# Altium schematic sheet BoardB-FPGA2.SchDoc
size A; SheetNumber: 3; SheetTotal: 7
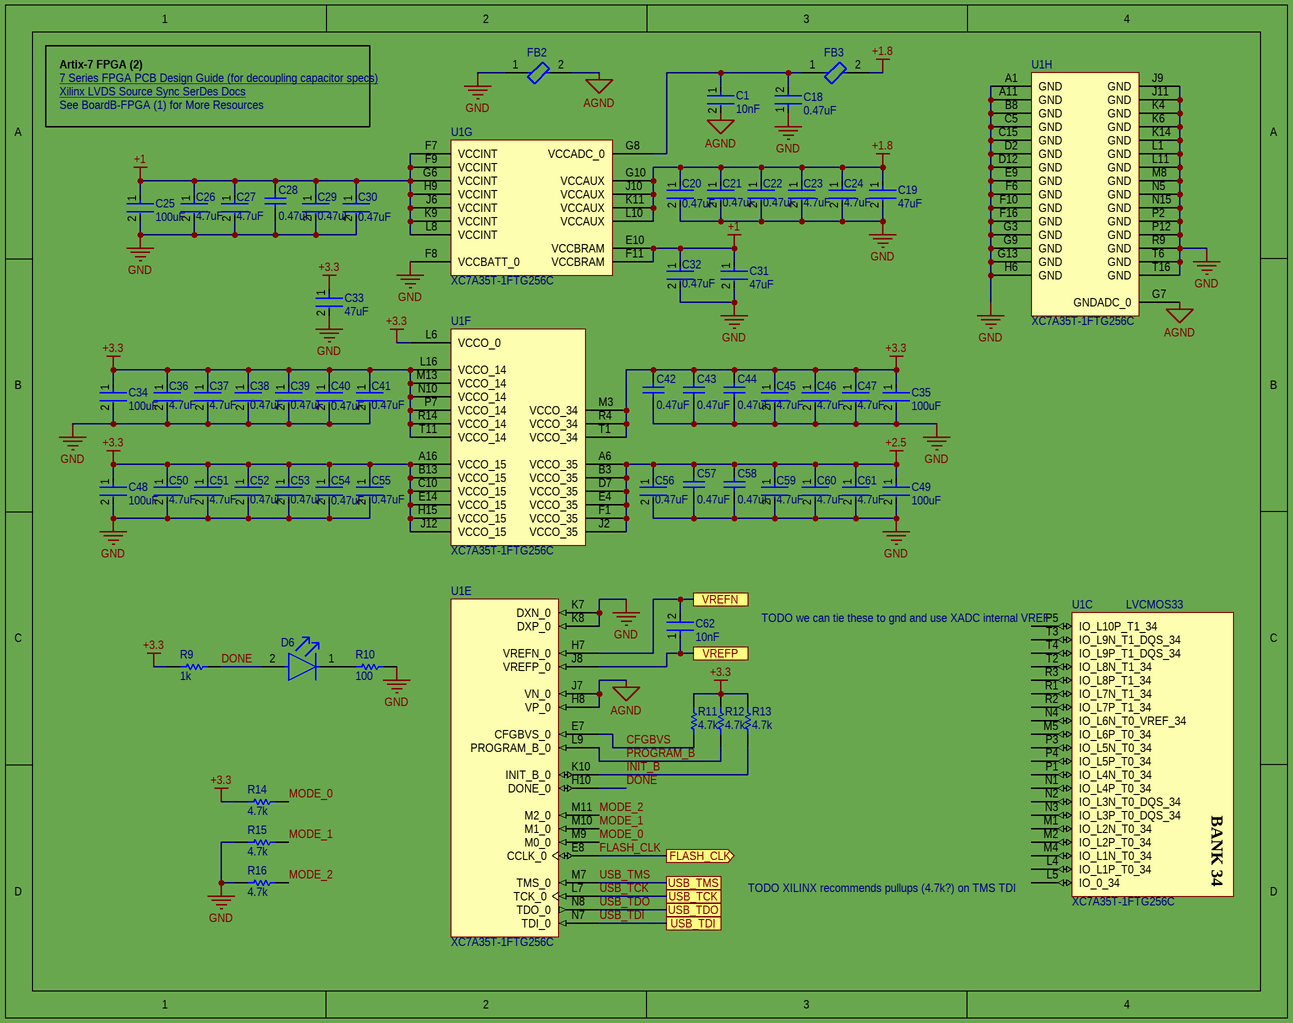
[diagram p0: BoardB-FPGA2.SchDoc]

## Parts
C1  10nF  [FP-GRM033-0_03-IPC_C]
C18  0.47uF  [FP-GRM033-0_03-IPC_C]
C19  47uF  [FP-GRM188-0_2-MFG]
C20  0.47uF  [FP-GRM033-0_03-IPC_C]
C21  0.47uF  [FP-GRM033-0_03-IPC_C]
C22  0.47uF  [FP-GRM033-0_03-IPC_C]
C23  4.7uF  [FP-GRM155-0_1-IPC_B]
C24  4.7uF  [FP-GRM155-0_1-IPC_B]
C25  100uF  [FP-GRM21B-0_2-e0_2_0_7-MFG]
C26  4.7uF  [FP-GRM155-0_1-IPC_B]
C27  4.7uF  [FP-GRM155-0_1-IPC_B]
C28  0.47uF  [CAPC1005X55X25LL05T10]
C29  0.47uF  [FP-GRM033-0_03-IPC_C]
C30  0.47uF  [FP-GRM033-0_03-IPC_C]
C31  47uF  [FP-GRM188-0_2-MFG]
C32  0.47uF  [FP-GRM033-0_03-IPC_C]
C33  47uF  [FP-GRM188-0_2-MFG]
C34  100uF  [FP-GRM21B-0_2-e0_2_0_7-MFG]
C35  100uF  [FP-GRM21B-0_2-e0_2_0_7-MFG]
C36  4.7uF  [FP-GRM155-0_1-IPC_B]
C37  4.7uF  [FP-GRM155-0_1-IPC_B]
C38  0.47uF  [FP-GRM033-0_03-IPC_C]
C39  0.47uF  [FP-GRM033-0_03-IPC_C]
C40  0.47uF  [FP-GRM033-0_03-IPC_C]
C41  0.47uF  [FP-GRM033-0_03-IPC_C]
C42  0.47uF  [CAPC1005X55X25LL05T10]
C43  0.47uF  [CAPC1005X55X25LL05T10]
C44  0.47uF  [CAPC1005X55X25LL05T10]
C45  4.7uF  [FP-GRM155-0_1-IPC_B]
C46  4.7uF  [FP-GRM155-0_1-IPC_B]
C47  4.7uF  [FP-GRM155-0_1-IPC_B]
C48  100uF  [FP-GRM21B-0_2-e0_2_0_7-MFG]
C49  100uF  [FP-GRM21B-0_2-e0_2_0_7-MFG]
C50  4.7uF  [FP-GRM155-0_1-IPC_B]
C51  4.7uF  [FP-GRM155-0_1-IPC_B]
C52  0.47uF  [FP-GRM033-0_03-IPC_C]
C53  0.47uF  [FP-GRM033-0_03-IPC_C]
C54  0.47uF  [FP-GRM033-0_03-IPC_C]
C55  0.47uF  [FP-GRM033-0_03-IPC_C]
C56  0.47uF  [FP-GRM033-0_03-IPC_C]
C57  0.47uF  [CAPC1005X55X25LL05T10]
C58  0.47uF  [CAPC1005X55X25LL05T10]
C59  4.7uF  [FP-GRM155-0_1-IPC_B]
C60  4.7uF  [FP-GRM155-0_1-IPC_B]
C61  4.7uF  [FP-GRM155-0_1-IPC_B]
C62  10nF  [FP-CC0201-BA-MFG]
D6  SML-D12U1WT86  [FP-SML-D12-MFG]  (value not drawn)
FB2  BLM18AG601SN1D  [FP-BLM18-0_15-t0_8-MFG]  (value not drawn)
FB3  BLM18AG601SN1D  [FP-BLM18-0_15-t0_8-MFG]  (value not drawn)
R9  1k  [RESC1005X40X25NL05T05]
R10  100  [RESC1005X40X25LL05T05]
R11  4.7k  [RESC1005X40X25LL05T05]
R12  4.7k  [RESC1005X40X25LL05T05]
R13  4.7k  [RESC1005X40X25LL05T05]
R14  4.7k  [RESC1005X40X25LL05T05]
R15  4.7k  [RESC1005X40X25LL05T05]
R16  4.7k  [RESC1005X40X25LL05T05]
U1  XC7A35T-1FTG256C  [FTG256]  (parts C,E,F,G,H of 8)

## Ports
FLASH_CLK (out), USB_TCK, USB_TDI, USB_TDO, USB_TMS, VREFN, VREFP

## Nets
+1: C25.1 C26.1 C27.1 C28.2 C29.1 C30.1 C31.1 C32.1 U1.E10(VCCBRAM) U1.F7(VCCINT) U1.F9(VCCINT) U1.F11(VCCBRAM) U1.G6(VCCINT) U1.H9(VCCINT) U1.J6(VCCINT) U1.K9(VCCINT) U1.L8(VCCINT)
+1.8: C19.1 C20.1 C21.1 C22.1 C23.1 C24.1 FB3.2 U1.G10(VCCAUX) U1.J10(VCCAUX) U1.K11(VCCAUX) U1.L10(VCCAUX)
+2.5: C49.1 C56.1 C57.2 C58.2 C59.1 C60.1 C61.1 U1.A6(VCCO_35) U1.B3(VCCO_35) U1.D7(VCCO_35) U1.E4(VCCO_35) U1.F1(VCCO_35) U1.J2(VCCO_35)
+3.3: C33.1 C34.1 C35.1 C36.1 C37.1 C38.1 C39.1 C40.1 C41.1 C42.2 C43.2 C44.2 C45.1 C46.1 C47.1 C48.1 C50.1 C51.1 C52.1 C53.1 C54.1 C55.1 R9.1 R11.2 R12.2 R13.2 R14.1 U1.A16(VCCO_15) U1.B13(VCCO_15) U1.C10(VCCO_15) U1.E14(VCCO_15) U1.H15(VCCO_15) U1.J12(VCCO_15) U1.L6(VCCO_0) U1.L16(VCCO_14) U1.M3(VCCO_34) U1.M13(VCCO_14) U1.N10(VCCO_14) U1.P7(VCCO_14) U1.R4(VCCO_34) U1.R14(VCCO_14) U1.T1(VCCO_34) U1.T11(VCCO_14)
AGND: C1.2 FB2.2 U1.G7(GNDADC_0) U1.H8(VP_0) U1.J7(VN_0)
GND: C18.1 C19.2 C20.2 C21.2 C22.2 C23.2 C24.2 C25.2 C26.2 C27.2 C28.1 C29.2 C30.2 C31.2 C32.2 C33.2 C34.2 C35.2 C36.2 C37.2 C38.2 C39.2 C40.2 C41.2 C42.1 C43.1 C44.1 C45.2 C46.2 C47.2 C48.2 C49.2 C50.2 C51.2 C52.2 C53.2 C54.2 C55.2 C56.2 C57.1 C58.1 C59.2 C60.2 C61.2 FB2.1 R10.2 R15.1 R16.1 U1.A1(GND) U1.A11(GND) U1.B8(GND) U1.C5(GND) U1.C15(GND) U1.D2(GND) U1.D12(GND) U1.E9(GND) U1.F6(GND) U1.F8(VCCBATT_0) U1.F10(GND) U1.F16(GND) U1.G3(GND) U1.G9(GND) U1.G13(GND) U1.H6(GND) U1.J9(GND) U1.J11(GND) U1.K4(GND) U1.K6(GND) U1.K7(DXN_0) U1.K8(DXP_0) U1.K14(GND) U1.L1(GND) U1.L11(GND) U1.M8(GND) U1.N5(GND) U1.N15(GND) U1.P2(GND) U1.P12(GND) U1.R9(GND) U1.T6(GND) U1.T16(GND)
CFGBVS: R11.1 U1.E7(CFGBVS_0)
DONE: D6.2(A) R9.2 U1.H10(DONE_0)
FLASH_CLK: U1.E8(CCLK_0) ; port FLASH_CLK
INIT_B: R13.1 U1.K10(INIT_B_0)
MODE_0: R14.2 U1.M9(M0_0)
MODE_1: R15.2 U1.M10(M1_0)
MODE_2: R16.2 U1.M11(M2_0)
PROGRAM_B: R12.1 U1.L9(PROGRAM_B_0)
USB_TCK: U1.L7(TCK_0) ; port USB_TCK
USB_TDI: U1.N7(TDI_0) ; port USB_TDI
USB_TDO: U1.N8(TDO_0) ; port USB_TDO
USB_TMS: U1.M7(TMS_0) ; port USB_TMS
VREFN: C62.2 U1.H7(VREFN_0) ; port VREFN
VREFP: C62.1 U1.J8(VREFP_0) ; port VREFP
NetC1_1: C1.1 C18.2 FB3.1 U1.G8(VCCADC_0)
NetD6_1: D6.1(C) R10.1

Not connected (* = marked no-connect by the designer): U1 L4(IO_L1P_T0_34) L5(IO_0_34) M1(IO_L2N_T0_34) M2(IO_L2P_T0_34) M4(IO_L1N_T0_34) M5(IO_L6P_T0_34) N1(IO_L4P_T0_34) N2(IO_L3N_T0_DQS_34) N3(IO_L3P_T0_DQS_34) N4(IO_L6N_T0_VREF_34) P1(IO_L4N_T0_34) P3(IO_L5N_T0_34) P4(IO_L5P_T0_34) P5(IO_L10P_T1_34) R1(IO_L7N_T1_34) R2(IO_L7P_T1_34) R3(IO_L8P_T1_34) T2(IO_L8N_T1_34) T3(IO_L9N_T1_DQS_34) T4(IO_L9P_T1_DQS_34)

## Notes on the sheet
- Artix-7 FPGA (2)
- 7 Series FPGA PCB Design Guide (for decoupling capacitor specs) <https://www.xilinx.com/support/documentation/user_guides/ug483_7Series_PCB.pdf>
- Xilinx LVDS Source Sync SerDes Docs <https://www.xilinx.com/content/dam/xilinx/support/documentation/application_notes/xapp585-lvds-source-synch-serdes-clock-multiplication.pdf>
- See BoardB-FPGA (1) for More Resources
- (near U1) TODO we can tie these to gnd and use XADC internal VREF
- LVCMOS33
- (near U1) TODO XILINX recommends pullups (4.7k?) on TMS TDI
- (in symbol CMP-0383-00028-1, part C) BANK 34

## Library data of the parts
C1 = CMP-2010-01684-2: Chip Multilayer Ceramic Capacitors for General Purpose, 0201, 10000pF, X7R, 15%, 10%, 10V; Package Quantity: 1; Width: 0.012inch; Voltage: 10V; Mount: Surface Mount; Capacitance: 10nF; Voltage Rating (DC): 10V; Voltage Rating: 10V; Length: 0.6mm; Packaging: Tape and Reel; Material: Ceramic; Dielectric: X7R; REACH SVHC: No SVHC; Termination: SMD/SMT; Case/Package: 0201; Radiation Hardening: No; Height: 0.3mm; Tolerance: 10%; Case Code (Imperial): 0201; Min Operating Temperature: -55°C; Lead Free: Lead Free; Thickness: 0.013inch; Depth: 0.3mm; Case Code (Metric): 0603; Max Operating Temperature: 125°C
C18 C20-C22 C29 C30 C32 C38-C41 C52-C56 = CMP-06035-010465-1: Chip Multilayer Ceramic Capacitors for General Purpose, 0201, 0.47uF, X5R, 15%, 10%, 6.3V; Capacitance: 470nF; Thickness: 0.013inch; Depth: 0.3mm; Height: 0.3mm; Mount: Surface Mount; Max Operating Temperature: 85°C; Tolerance: 10%; Dielectric: X5R; Length: 0.6mm; Package Quantity: 15000; Weight: 1.2E-05oz; Voltage Rating (DC): 6.3V; Lead Free: Lead Free; Termination: SMD/SMT; Voltage Rating: 6.3V; Case Code (Imperial): 0201; Width: 0.012inch; Case/Package: 0201; Case Code (Metric): 0603; Min Operating Temperature: -55°C; Packaging: Tape and Reel
C19 C31 C33 = CMP-2000-05444-2: Chip Multilayer Ceramic Capacitors for General Purpose, 0603, 47uF, X5R, 15%, 20%, 6.3V; Voltage Rating (DC): 6.3V; Thickness: 0.039inch; Case Code (Imperial): 0603; Packaging: Tape and Reel; Capacitance: 47uF; Width: 0.031inch; Dielectric: X5R; Max Operating Temperature: 85°C; Mount: Surface Mount; Case Code (Metric): 1608; Length: 0.063inch; Voltage Rating: 6.3V; Tolerance: 20%; Case/Package: 0603; Min Operating Temperature: -55°C
C23 C24 C26 C27 C36 C37 C45-C47 C50 C51 C59-C61 = CMP-2008-04549-2: Chip Multilayer Ceramic Capacitors for General Purpose, 0402, 4.7uF, X5R, 15%, 20%, 6.3V; Height: 0.5mm; Weight: 0.000212oz; Length: 1mm; Case Code (Metric): 1005; Packaging: Tape and Reel; Termination: SMD/SMT; Dielectric: X5R; Depth: 0.5mm; Case Code (Imperial): 0402; Min Operating Temperature: -55°C; Case/Package: 0402; Voltage: 6.3V; Width: 0.02inch; Capacitance: 4.7uF; Lead Free: Lead Free; Thickness: 0.022inch; Contact Plating: Tin; REACH SVHC: No SVHC; Package Quantity: 10000; Tolerance: 20%; Voltage Rating (DC): 6.3V; Voltage Rating: 6.3V; Mount: Surface Mount; Max Operating Temperature: 85°C
C25 C34 C35 C48 C49 = CMP-2000-07599-2: Chip Multilayer Ceramic Capacitors for General Purpose, 0805, 100uF, X5R, 15%, 20%, 6.3V; Length: 0.079inch; Dielectric: X5R; Case Code (Metric): 2012; Max Operating Temperature: 85°C; Voltage Rating (DC): 6.3V; Min Operating Temperature: -55°C; Tolerance: 20%; Packaging: Cut Tape; Voltage Rating: 6.3V; Capacitance: 100uF; REACH SVHC: No SVHC; Width: 0.049inch; Mount: Surface Mount; Case/Package: 0805; Case Code (Imperial): 0805; Lead Free: Lead Free; Thickness: 0.057inch
C28 C42-C44 C57 C58 = CMP-2008-04548-1: Manufacturer: Murata; Part Number: GRM155R60J474KE19D
C62 = CMP-03422-000237-1: CAP CER 10000PF 16V X7R 0201; Manufacturer: Yageo; Manufacturer Part Number: CC0201KRX7R7BB103; Material: Ceramic; Tolerance: 0.1; Temperature Coefficient: 15%; Ipc Land Pattern Name: CAPC6030X30; Value: 10 nF; Footprint Url: http://www.yageo.com/exep/pages/download/literatures/UPY-C_GEN_24.pdf; Device Class L2: Capacitors; Mouser Description: Multilayer Ceramic Capacitors MLCC - SMD/SMT 10nF 16V X7R 10%; Octopart: https://octopart.com/cc0201krx7r7bb103-yageo-9292627; Temperature: -55°C to +85°C; Package: CC0201-BA; Capacitance: 10 nF; Device Class L1: Passive Components; Device Class L3: Ceramic Capacitors; Digikey Description: CAP CER 10000PF 16V X7R 0201; ComponentLink2URL: http://www.yageo.com/documents/recent/UPY-GPHC_X5R_4V-to-50V_25.pdf; Temperature Characteristic: X7R; Automotive: No; RoHS: TRUE; Voltage Rating: 16 V; Temperature Range Low: -55°C; Category: Cap; Height: 0.33mm; ComponentLink2Description: Datasheet; Temperature Range High: +85°C; Lead Free: Yes
D6 = CMP-08952-000009-1: LED RED DIFFUSED 1608 SMD; Manufacturer: Rohm; Led Orientation: Top View; Power Dissipation: 54mW; Forward Current: 20mA; Wavelength: 620nm; Reverse Voltage: 5V; Luminous Intensity: 63mcd; Forward Voltage: 2.2V; Mouser Description: SML-D12 Series Red 0603 Diffused 63 mcd 2.2 V Surface Mount LED; Temperature: -40°C to +85°C; Device Class L2: LEDs; Lead Free: Yes; Automotive: No; Octopart: https://octopart.com/sml-d12u1wt86-rohm-70850259; RoHS: TRUE; Colour: Red; Digikey Description: LED RED DIFFUSED 1608 SMD; Package: SML-D12; Device Class L1: Optoelectronics; Category: Diode; Temperature Range High: +85°C; Height: 0.65mm; ComponentLink2Description: Datasheet; Temperature Range Low: -40°C; ComponentLink2URL: https://www.rohm.com/datasheet/SML-D12U1W/sml-d12x1-e; Manufacturer Part Number: SML-D12U1WT86; Device Class L3: unset
FB2 FB3 = CMP-0686-00436-3: Chip Ferrite Bead, 0603, 600Ω @ 100MHz, 0.38Ω, 25%, 500mA; Number of Lines: 1; Impedance: 600R; DC Resistance (DCR): 380mR; Material: Steel; Shielding: Unshielded; Max DC Current: 500mA; Termination: SMD/SMT; Military Standard: Not; Number of Circuits: 1; Min Operating Temperature: -55°C; Case Code (Imperial): 0603; Width: 0.8mm; Current Rating: 500mA; Lead Free: Lead Free; Packaging: Tape and Reel; Frequency: 100MHz; Max Operating Temperature: 125°C; DC Current: 500mA; REACH SVHC: No SVHC; Case/Package: 0603; Package Quantity: 1; Height: 0.8mm; Number of Pins: 2; Depth: 0.8mm; Test Frequency: 100MHz; Case Code (Metric): 1608; Tolerance: 25%; Core Material: Ferrite; Weight: 7.1E-05oz; Max Current Rating: 500mA; Radiation Hardening: No; Length: 1.6mm; RoHS Compliant: Yes
R9 = CMP-1011-00510-4: Chip Resistor, 1 KOhm, +/- 1%, 100 mW, -55 to 155 degC, 0402 (1005 Metric), RoHS, Tape and Reel; PartNumber: ERJ-2RKF1001X; Manufacturer: Basic Passives; Voltage Rating: 50 V; Case\/Package: 0402; Resistance: 1 KOhm; Power Rating: 100 mW; DatasheetVersion: 04/2015; Radiation Hardening: No; Pins: 2; Height: 0.35 mm; RoHSCompliant: true; Case Code (Imperial): 0402; ComponentLink2Description: Datasheet; ComponentLink1Description: Manufacturer URL; PackageReference: 0402; Mount: Surface Mount; Package Quantity: 10000; Tolerance: 1%; ComponentLink1URL: http://www.panasonic.com/; PackageDescription: 2-Pin Surface Mount Device, Body 1 x 0.5 mm; Mounting Technology: Surface Mount; Case Code (Metric): 1005; ComponentLink2URL: http://industrial.panasonic.com/cdbs/www-data/pdf/RDA0000/AOA0000C86.pdf; REACH SVHC: Yes; Packaging: Tape and Reel; Max Operating Temperature: 155 degC; Min Operating Temperature: -55 degC; Width: 0.5 mm; Length: 1 mm
R10 = CMP-2002-00605-3: Chip Resistor, 100 Ohm, +/- 1%, 100 mW, -55 to 155 degC, 0402 (1005 Metric), RoHS, Tape and Reel; Manufacturer: Basic Passives; PartNumber: ERJ-2RKF1000X; Power Rating: 100 mW; Resistance: 100 Ohm; Voltage Rating: 50 V; Case\/Package: 0402; Width: 0.5 mm; Pins: 2; ComponentLink2Description: Datasheet; PackageReference: 0402; Height: 0.35 mm; Tolerance: 1%; DatasheetVersion: 04/2015; Case Code (Imperial): 0402; Min Operating Temperature: -55 degC; Radiation Hardening: No; Length: 1 mm; Package Quantity: 10000; PackageDescription: 2-Pin Surface Mount Device, Body 1 x 0.5 mm; Mounting Technology: Surface Mount; Case Code (Metric): 1005; Packaging: Tape and Reel; ComponentLink1URL: http://www.panasonic.com/; RoHSCompliant: true; Max Operating Temperature: 155 degC; REACH SVHC: Yes; ComponentLink1Description: Manufacturer URL; ComponentLink2URL: http://industrial.panasonic.com/cdbs/www-data/pdf/RDA0000/AOA0000C86.pdf; Mount: Surface Mount
R11-R16 = CMP-2002-01154-4: Chip Resistor, 4.7 KOhm, +/- 1%, 0.1 W, -55 to 155 degC, 0402 (1005 Metric), RoHS, Tape and Reel; PartNumber: ERJ-2RKF4701X; Voltage Rating: 50 V; Case\/Package: 0402; Power Rating: 100 mW; Height: 0.35 mm; Mounting Technology: Surface Mount; REACH SVHC: Yes; Resistance: 4.7 KOhm; Max Operating Temperature: 155 degC; ComponentLink1Description: Manufacturer URL; ComponentLink2Description: Datasheet; Pins: 2; PackageReference: 0402; Tolerance: 1%; Case Code (Imperial): 0402; Length: 1 mm; PackageDescription: 2-Pin Surface Mount Device, Body 1 x 0.5 mm; RoHSCompliant: true; Package Quantity: 1; Radiation Hardening: No; DatasheetVersion: 04/2015; Width: 0.5 mm; Case Code (Metric): 1005; Mount: Surface Mount; ComponentLink1URL: http://www.panasonic.com/; Min Operating Temperature: -55 degC; Packaging: Cut Tape; ComponentLink2URL: http://industrial.panasonic.com/cdbs/www-data/pdf/RDA0000/AOA0000C86.pdf
U1 = CMP-0383-00028-1: Artix-7 FPGA, 170 User I/Os, 0 GTP, 256-Ball BGA, Speed Grade 1, Commercial Grade, Pb-Free; Manufacturer: Xilinx; Speed Grades: 1; Total Block RAM: 1800 Kb; CMTs: 5; GTP: 0; Available User I/O: 170; Logic Cells: 33280; ComponentLink2Description: Datasheet; ComponentLink2URL: http://www.xilinx.com/support/documentation/data_sheets/ds180_7Series_Overview.pdf; ComponentLink1Description: Manufacturer URL; Operating Temperature Range: Commercial; PackageVersion: Rev. 1.11; ComponentLink4URL: http://www.xilinx.com/support/documentation/user_guides/ug475_7Series_Pkg_Pinout.pdf; ComponentLink4Description: Package Specification; PackageDescription: 256-Ball Wire-Bond Fine-Pitch Thin BGA, Body 17 x 17 mm, Pitch 1 mm; Mounting Technology: Surface Mount; ComponentLink1URL: http://www.xilinx.com/; Maximum Distributed RAM: 400 Kb; PackageReference: FTG-256; DatasheetVersion: Rev. 1.15; ComponentLink3Description: Pinout; PartNumber: XC7A35T-1FTG256C; ComponentLink3URL: http://www.xilinx.com/support/documentation/user_guides/ug475_7Series_Pkg_Pinout.pdf